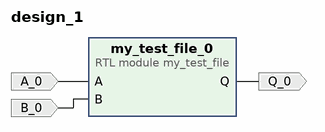
[diagram p0: block diagram of the top level]
# Vivado block design design_1, xc7z007sclg225-1, Vivado 2018.2
create_bd_design design_1

create_bd_port -dir O Q_0
create_bd_port -dir I A_0
create_bd_port -dir I B_0

create_bd_cell -type module -reference my_test_file my_test_file_0

# ---- connections ----

connect_bd_net [get_bd_pins my_test_file_0/Q] [get_bd_ports Q_0]
connect_bd_net -net A_0_1 [get_bd_ports A_0] [get_bd_pins my_test_file_0/A]
connect_bd_net -net B_0_1 [get_bd_ports B_0] [get_bd_pins my_test_file_0/B]

validate_bd_design
save_bd_design
